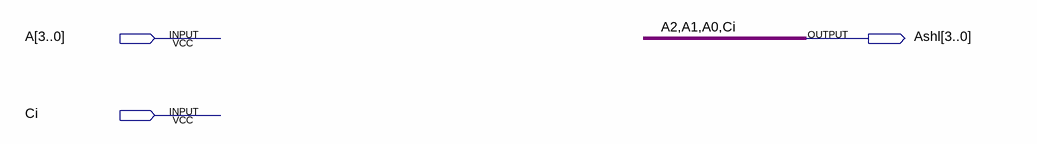
[diagram p0: schematic sheet]
// Quartus schematic SHL4.bdf as structural Verilog: 0 symbols, 3 pins
module SHL4 (
  input  [3:0] A,
  input  Ci,
  output [3:0] Ashl
);


  assign Ashl = {A[2:0], Ci};
endmodule
